# Altium schematic sheet L298N_Motor.SchDoc
size A4; SheetNumber: 6; SheetTotal: 7
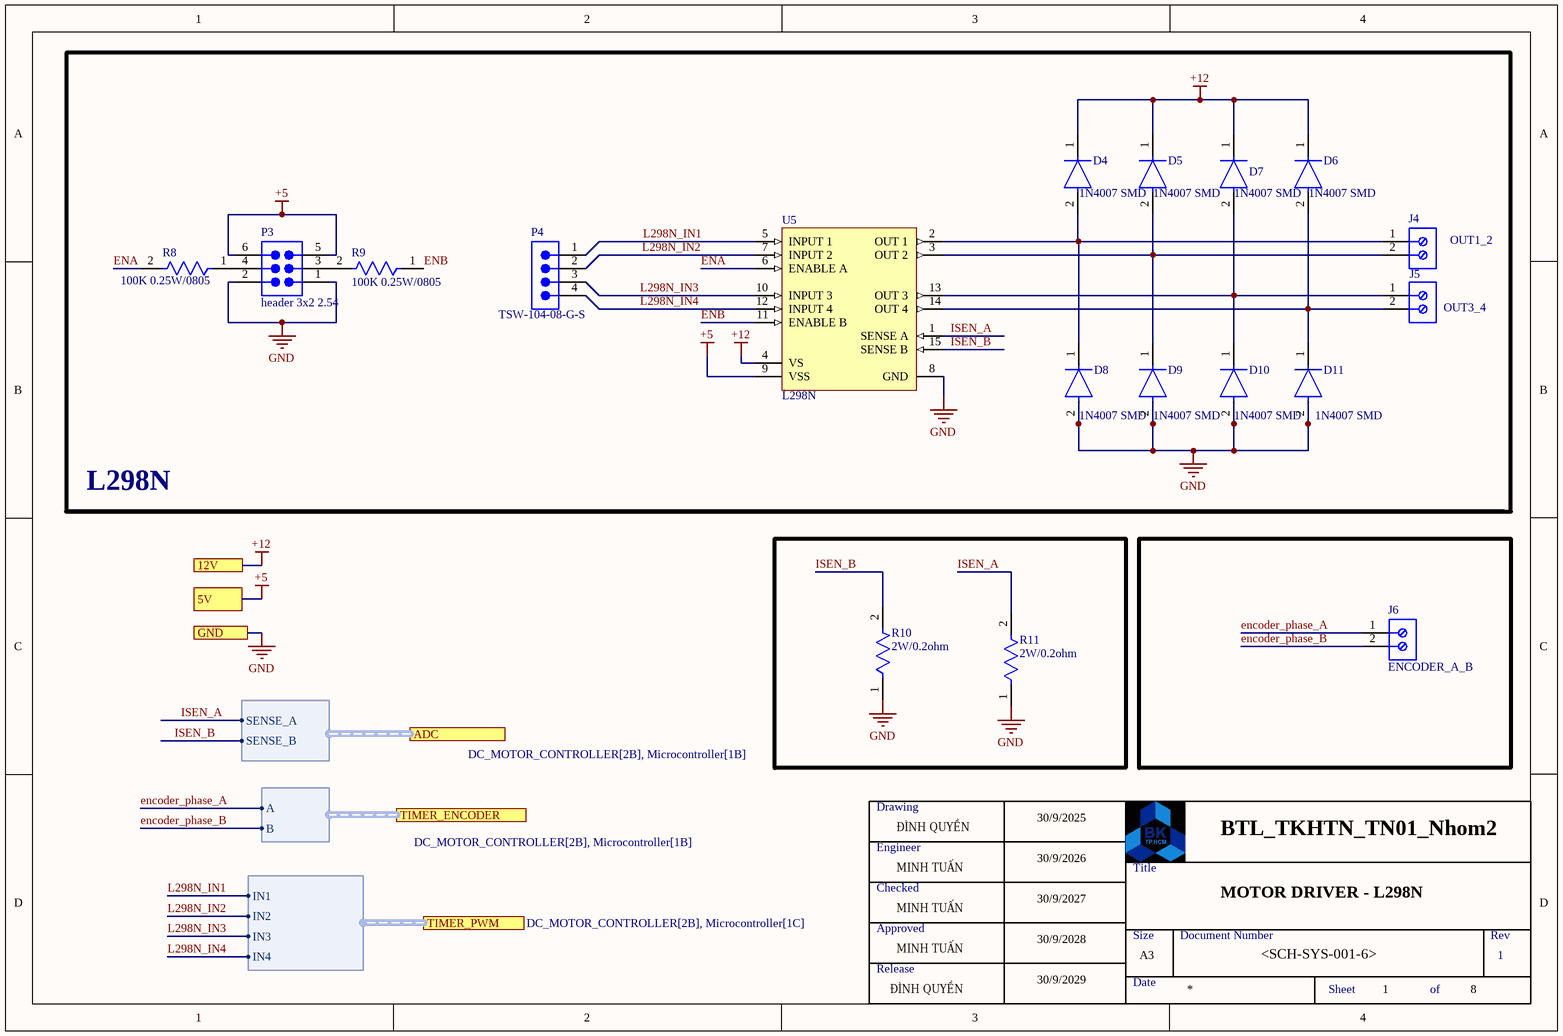
[diagram p0: L298N_Motor.SchDoc]

## Parts
D4  1N4007 SMD  [FP-1N4007_SMD-IPC_C]
D5  1N4007 SMD  [FP-1N4007_SMD-IPC_C]
D6  1N4007 SMD  [FP-1N4007_SMD-IPC_C]
D7  1N4007 SMD  [FP-1N4007_SMD-IPC_C]
D8  1N4007 SMD  [FP-1N4007_SMD-IPC_C]
D9  1N4007 SMD  [FP-1N4007_SMD-IPC_C]
D10  1N4007 SMD  [FP-1N4007_SMD-IPC_C]
D11  1N4007 SMD  [FP-1N4007_SMD-IPC_C]
J4  OUT1_2  [691254710002]
J5  OUT3_4  [691254710002]
J6  ENCODER_A_B  [691254710002]
P3  header 3x2 2.54  [SMTC-TSW-103-08-X-D]
P4  TSW-104-08-G-S  [SMTC-TSW-104-08-X-S]
R8  100K 0.25W/0805  [FP-AF0805-IPC_C]
R9  100K 0.25W/0805  [FP-AF0805-IPC_C]
R10  2W/0.2ohm  [FP-ERG3S-MFG]
R11  2W/0.2ohm  [FP-ERG3S-MFG]
U5  L298N  [STM-FM-15]

## Blocks framed on the sheet
L298N: D4-D11 J4 J5 P3 P4 R8 R9 U5

## Ports
5V (see DC_MOTOR_CONTROLLER[1B], 78M05_RT9193[2A], Microcontroller[1A]), 12V (see DC_MOTOR_CONTROLLER[1B], 78M05_RT9193[1A]), ADC (harness ADC, see DC_MOTOR_CONTROLLER[2B], Microcontroller[1B]), GND (see DC_MOTOR_CONTROLLER[1B], 78M05_RT9193[2A], Led_Button[1A], Microcontroller[1A], UART_CH340G[1A]), TIMER_ENCODER (harness encoder, see DC_MOTOR_CONTROLLER[2B], Microcontroller[1B]), TIMER_PWM (harness PWM, see DC_MOTOR_CONTROLLER[2B], Microcontroller[1C])

## Harnesses
PWM: IN1, IN2, IN3, IN4
encoder: A, B
ADC: SENSE_B, SENSE_A

## Nets
+5: P3.5 P3.6 U5.9(VSS) ; port 5V
+12: D4.1(C) D5.1(C) D6.1(C) D7.1(C) U5.4(VS) ; port 12V
GND: D8.2(A) D9.2(A) D10.2(A) D11.2(A) P3.1 P3.2 R10.1 R11.1 U5.8(GND) ; port GND
ENA: R8.2 U5.6(ENABLE_A)
ENB: R9.1 U5.11(ENABLE_B)
encoder_phase_A: J6.1 ; port TIMER_ENCODER.A
encoder_phase_B: J6.2 ; port TIMER_ENCODER.B
ISEN_A: R11.2 U5.1(SENSE_A) ; port ADC.SENSE_A
ISEN_B: R10.2 U5.15(SENSE_B) ; port ADC.SENSE_B
L298N_IN1: P4.1 U5.5(INPUT_1) ; port TIMER_PWM.IN1
L298N_IN2: P4.2 U5.7(INPUT_2) ; port TIMER_PWM.IN2
L298N_IN3: P4.3 U5.10(INPUT_3) ; port TIMER_PWM.IN3
L298N_IN4: P4.4 U5.12(INPUT_4) ; port TIMER_PWM.IN4
NetD4_2: D4.2(A) D8.1(C) J4.1 U5.2(OUT_1)
NetD5_2: D5.2(A) D9.1(C) J4.2 U5.3(OUT_2)
NetD6_2: D6.2(A) D11.1(C) J5.2 U5.14(OUT_4)
NetD7_2: D7.2(A) D10.1(C) J5.1 U5.13(OUT_3)
NetP3_3: P3.3 R9.2
NetP3_4: P3.4 R8.1

## Notes on the sheet
- Drawing
- Engineer
- ĐÌNH QUYỀN
- 30/9/2025
- BTL_TKHTN_TN01_Nhom2
- Checked
- MINH TUẤN
- 30/9/2026
- 30/9/2027
- Title
- MOTOR DRIVER - L298N
- Approved
- Release
- 30/9/2028
- 30/9/2029
- Size
- Date
- A3
- Document Number
- <SCH-SYS-001-6>
- Rev
- 1
- Sheet
- of
- 8

## Library data of the parts
D4-D11 = CMP-12389-000001-1: Rectifier, 1Kv, 1A, Do-214Ac Rohs Compliant: Yes
J4-J6 = CMP-1502-02591-2: NexarPartId: 105950848
P3 = CMP-1024-00337-1: 0.025" SQ Post Header, Through-hole, Vertical, -55 to 125 degC, 2.54 mm Pitch, 6-Pin, Male, RoHS; Manufacturer: Samtec; PartNumber: TSW-103-08-F-D; Pitch: 2.54 mm; ComponentLink1URL: http://www.samtec.com; PackageReference: TSW-103-08-X-D; ComponentLink3Description: Package Specification; PackageDescription: .025[0.64] SQ. Post Terminal Strip Assembly; DatasheetVersion: F-214; ComponentLink1Description: Manufacturer URL; ComponentLink2Description: Datasheet; ComponentLink2URL: http://www.samtec.com/documents/webfiles/pdf/TSW_TH.PDF; PackageVersion: DM, 8/1988; Orientation: Vertical; Mounting Technology: Through-hole; RoHS: True; Temperature Range: -55 to 125 degC; ComponentLink3URL: http://www.samtec.com/documents/webfiles/cpdf/TSW-XXX-XX-XXX-X-XX-XXX-MKT.pdf
P4 = CMP-1024-00357-1: 0.025" SQ Post Header, Through-hole, Vertical, -55 to 125 degC, 2.54 mm Pitch, 4-Pin, Male, RoHS; Manufacturer: Samtec; Pitch: 2.54 mm; RoHS: True; ComponentLink3URL: http://www.samtec.com/documents/webfiles/cpdf/TSW-XXX-XX-XXX-X-XX-XXX-MKT.pdf; Mounting Technology: Through-hole; ComponentLink2URL: http://www.samtec.com/documents/webfiles/pdf/TSW_TH.PDF; ComponentLink1URL: http://www.samtec.com; ComponentLink3Description: Package Specification; PackageVersion: DM, 8/1988; ComponentLink2Description: Datasheet; PackageReference: TSW-104-08-X-S; PackageDescription: .025[0.64] SQ. Post Terminal Strip Assembly; PartNumber: TSW-104-08-G-S; ComponentLink1Description: Manufacturer URL; Temperature Range: -55 to 125 degC; DatasheetVersion: F-214; Orientation: Vertical
R8 R9 = CMP-03412-045285-1: Anti-Sulfurated Chip Resistor Automotive Grade 75Ω 1% 0.125W ±100ppm/°C 0805; Max Power Dissipation: 125mW; Resistance: 75R; Resistor Type: Thick Film; Number of Terminations: 2; Min Operating Temperature: -55°C; Packaging: Tape and Reel; Height: 0.024inch; Max Operating Temperature: 155°C; Series: AF; Case/Package: 0805; Tolerance: 1%; Length: 0.079inch; Width: 0.049inch; Features: Moisture Resistant; RoHS Compliant: Yes; Temperature Coefficient: 100ppm/°C
R10 R11 = CMP-00287-55648916-1: ERG-3SJ361A Res Metal Oxide Film 360 Ohm 5% 3W ±300ppm/C Conformal Coated AXL; Voltage Rating: 700V; Lead Diameter: 800µm; Temperature Coefficient: 300ppm/°C; Voltage Rating (DC): 350V; Resistance: 360Ω; Max Power Dissipation: 3W; Diameter: 5.5mm; Mount: Through Hole; Composition: Metal Oxide; Tolerance: 5%; Number of Terminations: 2; Schedule B: 8533210090, 8533210090; Weight: 1.470008g; Case/Package: Axial; NexarPartId: 55648916; Min Operating Temperature: -55°C; Length: 15mm; Contact Plating: Tin; Power Rating: 3W; RoHS: Compliant; Max Operating Temperature: 200°C; Radiation Hardening: No; Termination: Axial
U5 = CMP-2000-06526-1: Dual Full-Bridge Driver, 4.8 to 46 V, -40 to 150 degC, 15-Pin FM (MW 15L), RoHS, Tube; Manufacturer: STMicroelectronics; PartNumber: L298; Output Current: 2A; Supply Voltage Max: 7V; Driver Case Style: Multiwatt; Supply Voltage Min: 4.5V; No. of Pins: 15Pins; SVHC: NoSVHC(17-Dec-2015); Output Voltage: 46V; No. of Outputs: 4Outputs; Motor Type: FullBridge; MSL: -; Package Description: 15-Pin Flange Mount, Body 5 x 19.6 mm, Pitch 1.27 mm; Datasheet Version: 01/2000; Package Reference: FM-15; Mounting Technology: ThroughHole; Packaging: Each; Automotive Qualification Standard: -; Product Range: -; Datasheet URL: https://datasheet.ciiva.com/15109/getdatasheetpartid-50682-15109332.pdf; Operating Temperature Max: 130°C; Operating Temperature Min: -25°C; Manufacturer URL: http://www.st.com/